# Altium schematic sheet 4_MCU.SchDoc
size A3
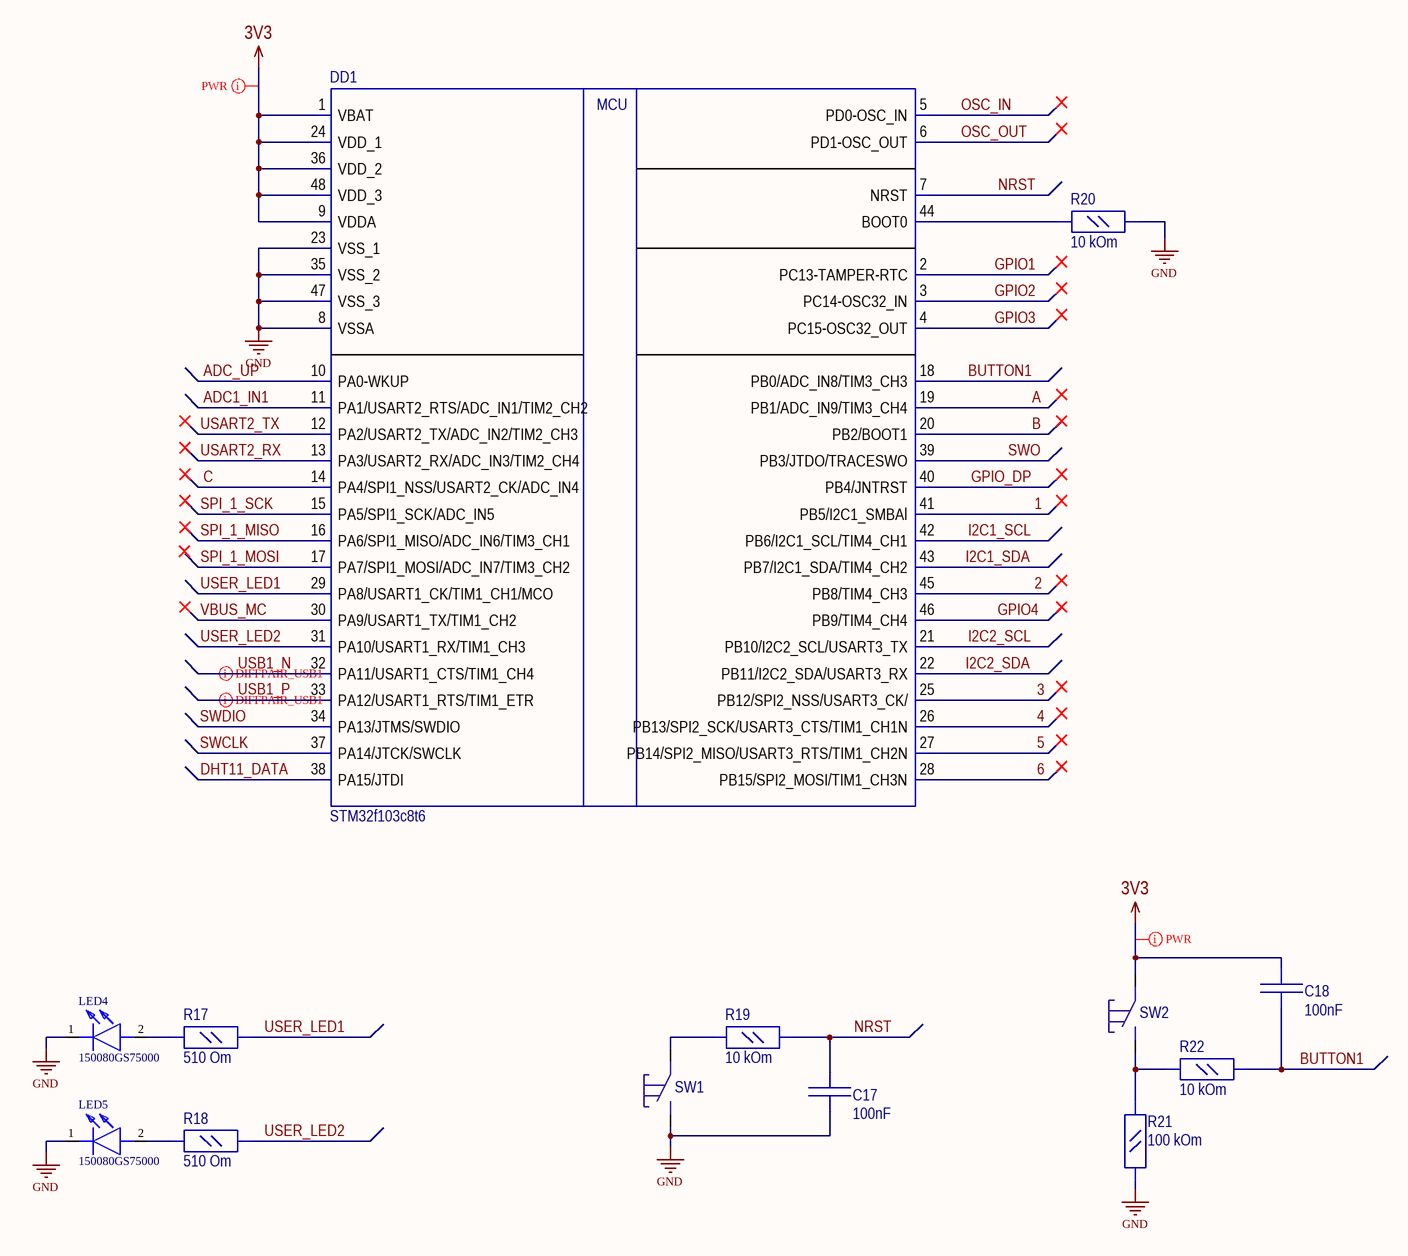
[diagram p0: 4_MCU.SchDoc]

## Parts
C17  100nF  [C_0805]
C18  100nF  [C_0805]
DD1  STM32f103c8t6  [LQFP48]
LED4  150080GS75000  [LEDM2012X80N]
LED5  150080GS75000  [LEDM2012X80N]
R17  510 Om  [R_0805]
R18  510 Om  [R_0805]
R19  10 kOm  [R_0805]
R20  10 kOm  [R_0805]
R21  100 kOm  [R_0805]
R22  10 kOm  [R_0805]
SW1  KLS7-TS6604  [KLS7-TS6604-5.0-180-B]  (value not drawn)
SW2  KLS7-TS6604  [KLS7-TS6604-5.0-180-B]  (value not drawn)

## Nets
3V3: C18.2 DD1.1(VBAT) DD1.9(VDDA) DD1.24(VDD_1) DD1.36(VDD_2) DD1.48(VDD_3) SW2.2
GND: C17.1 DD1.8(VSSA) DD1.23(VSS_1) DD1.35(VSS_2) DD1.47(VSS_3) LED4.1(K) LED5.1(K) R20.1 R21.2 SW1.1
1: DD1.41(PB5/I2C1_SMBAl)
2: DD1.45(PB8/TIM4_CH3)
3: DD1.25(PB12/SPI2_NSS/USART3_CK/)
4: DD1.26(PB13/SPI2_SCK/USART3_CTS/TIM1_CH1N)
5: DD1.27(PB14/SPI2_MISO/USART3_RTS/TIM1_CH2N)
6: DD1.28(PB15/SPI2_MOSI/TIM1_CH3N)
A: DD1.19(PB1/ADC_IN9/TIM3_CH4)
ADC1_IN1: DD1.11(PA1/USART2_RTS/ADC_IN1/TIM2_CH2)
ADC_UP: DD1.10(PA0-WKUP)
B: DD1.20(PB2/BOOT1)
BUTTON1: C18.1 DD1.18(PB0/ADC_IN8/TIM3_CH3) R22.1
C: DD1.14(PA4/SPI1_NSS/USART2_CK/ADC_IN4)
DHT11_DATA: DD1.38(PA15/JTDI)
GPIO1: DD1.2(PC13-TAMPER-RTC)
GPIO2: DD1.3(PC14-OSC32_IN)
GPIO3: DD1.4(PC15-OSC32_OUT)
GPIO4: DD1.46(PB9/TIM4_CH4)
GPIO_DP: DD1.40(PB4/JNTRST)
I2C1_SCL: DD1.42(PB6/I2C1_SCL/TIM4_CH1)
I2C1_SDA: DD1.43(PB7/I2C1_SDA/TIM4_CH2)
I2C2_SCL: DD1.21(PB10/I2C2_SCL/USART3_TX)
I2C2_SDA: DD1.22(PB11/I2C2_SDA/USART3_RX)
NRST: C17.2 DD1.7(NRST) R19.1
OSC_IN: DD1.5(PD0-OSC_IN)
OSC_OUT: DD1.6(PD1-OSC_OUT)
SPI_1_MISO: DD1.16(PA6/SPI1_MISO/ADC_IN6/TIM3_CH1)
SPI_1_MOSI: DD1.17(PA7/SPI1_MOSI/ADC_IN7/TIM3_CH2)
SPI_1_SCK: DD1.15(PA5/SPI1_SCK/ADC_IN5)
SWCLK: DD1.37(PA14/JTCK/SWCLK)
SWDIO: DD1.34(PA13/JTMS/SWDIO)
SWO: DD1.39(PB3/JTDO/TRACESWO)
USART2_RX: DD1.13(PA3/USART2_RX/ADC_IN3/TIM2_CH4)
USART2_TX: DD1.12(PA2/USART2_TX/ADC_IN2/TIM2_CH3)
USB1_N: DD1.32(PA11/USART1_CTS/TIM1_CH4)
USB1_P: DD1.33(PA12/USART1_RTS/TIM1_ETR)
USER_LED1: DD1.29(PA8/USART1_CK/TIM1_CH1/MCO) R17.1
USER_LED2: DD1.31(PA10/USART1_RX/TIM1_CH3) R18.1
VBUS_MC: DD1.30(PA9/USART1_TX/TIM1_CH2)
NetDD1_44: DD1.44(BOOT0) R20.2
NetLED4_2: LED4.2(A) R17.2
NetLED5_2: LED5.2(A) R18.2
NetR19_2: R19.2 SW1.2
NetR21_1: R21.1 R22.2 SW2.1

## Layout directives
differential pair; differential pair class USB1: USB1_N, USB1_P
net class PWR: 3V3

## Notes on the sheet
- Title
- Size:
- Date:
- A3
- Number:
- Time:
- Revision:
- Sheet
- of
- File:
- (in symbol STM32f103c8t6) MCU

## Library data of the parts
C17 C18 = C_0805: Value: 100nF
LED4 LED5 = 150080GS75000: LED; Manufacturer_Name: Wurth Elektronik; Datasheet Link: https://katalog.we-online.com/led/datasheet/150080GS75000.pdf; Height: 0.8mm; Manufacturer_Part_Number: 150080GS75000; Mouser Part Number: 710-150080GS75000; Mouser Price/Stock: https://www.mouser.co.uk/ProductDetail/Wurth-Elektronik/150080GS75000?qs=2kOmHSv6VfQRoTEZVk1mGA%3D%3D
R17-R20 R22 = R_0805
  R17 R18: Value: 510 Om
  R19 R20 R22: Value: 10 kOm
R21 = R_0805: Value: 10 kOm